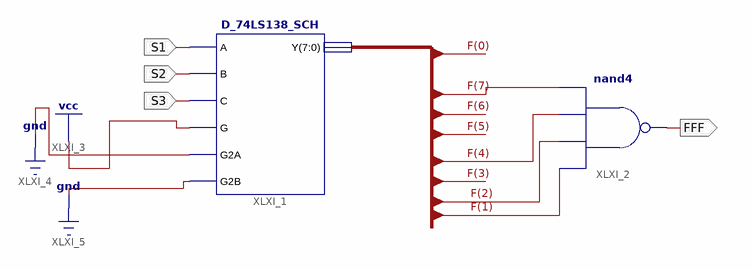
[diagram p0: schematic sheet 1]
// Xilinx ISE schematic test.sch (kintex7) as structural Verilog: 2 symbols, 4 ports
module test (
  input  S1,
  input  S2,
  input  S3,
  output FFF
);

  wire [7:0] F;

  D_74LS138_SCH XLXI_1 (.A(S1), .B(S2), .C(S3), .G(1'b1), .G2A(1'b0), .G2B(1'b0), .Y(F));
  nand XLXI_2 (FFF, F[1], F[2], F[4], F[7]);
endmodule
